# Altium schematic sheet SAMR21_Xplained_Pro_Target_MCU.SchDoc: Target MCU
size A3; Organization: ATMEL Norway; Address1: Vestre Rosten 79; Address2: N-7075 TILLER; Address3: NORWAY; DocumentNumber: A09-2127; Revision: 3; SheetNumber: 2; SheetTotal: 7; PageSetup: Record=PageOptions|CenterHorizontal=True|CenterVertical=True|PrintScale=1.01|XCorrection=1.00|YCorrection=1.00|PrintKind=1|BorderSize=5000000|LeftOffset=0|BottomOffset=0|Orientation=2|PaperLength=1000|PaperWidth=1000|Scale=100|PaperSource=7|PrintQuality=-4|MediaType=1|DitherType=10|PaperKind=A3 (297 x 420 mm)|PrintScaleMode=1
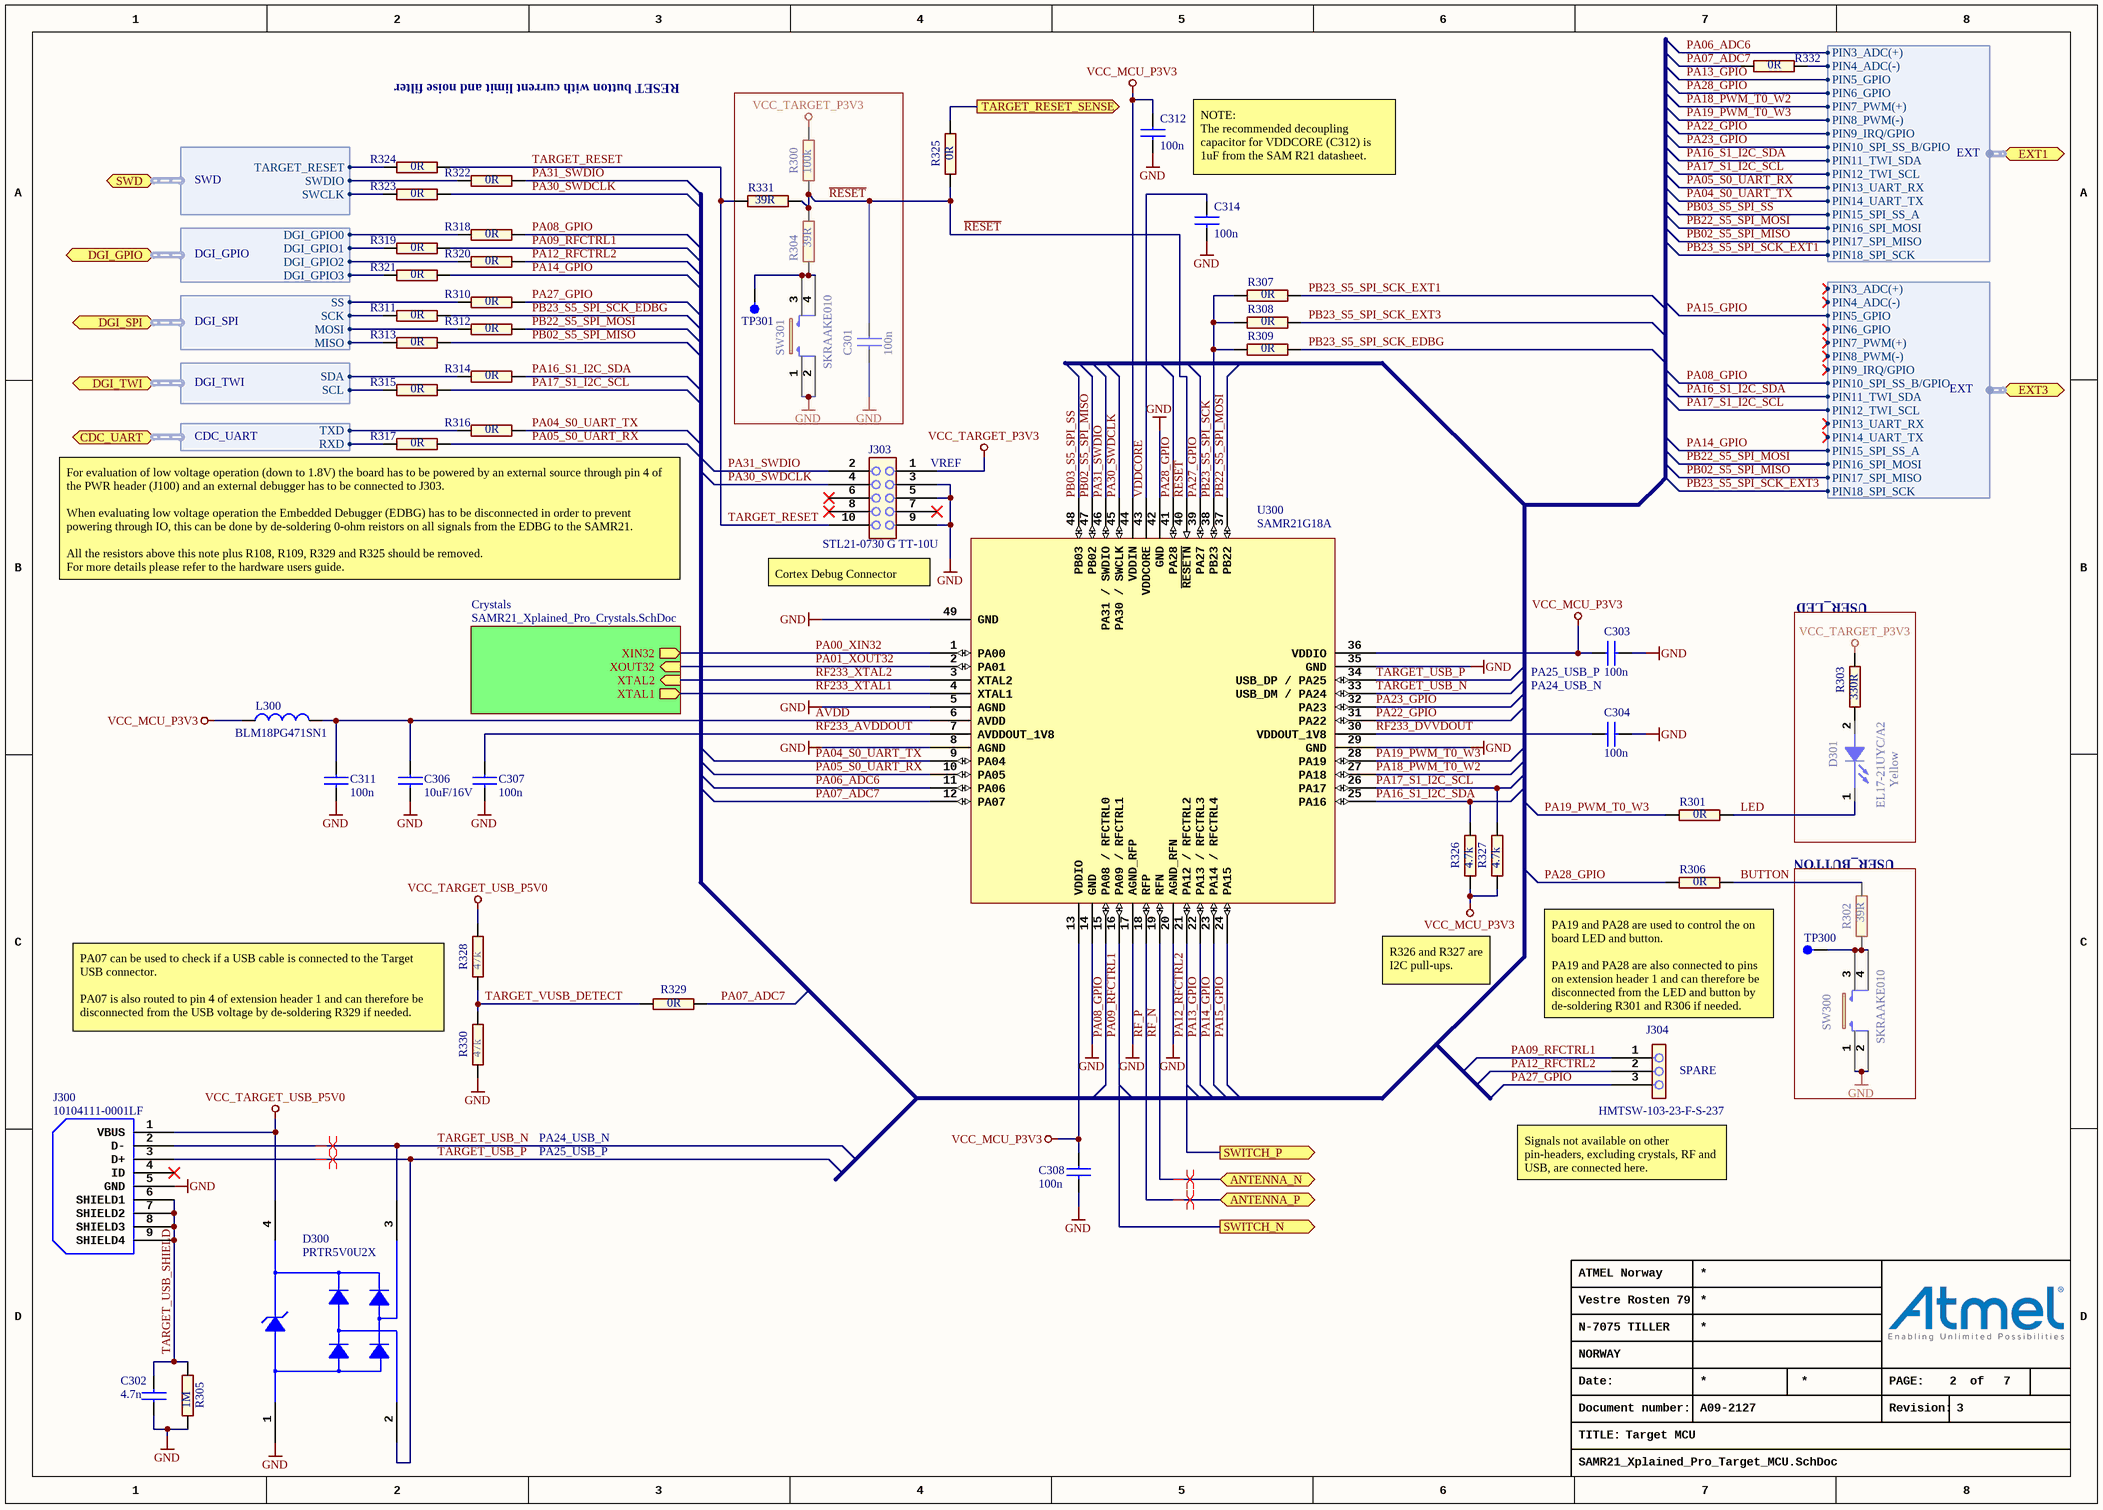
[diagram p0: SAMR21_Xplained_Pro_Target_MCU.SchDoc]

## Parts
C301  100n  [AP1-00053]
C302  value 4.7n  [AP1-00053]  (hidden comment: CAP-NONPOL)
C303  value 100n  [AP1-00001]  (hidden comment: CAP-NONPOL)
C304  value 100n  [AP1-00001]  (hidden comment: CAP-NONPOL)
C306  value 10uF/16V  [AP1-00039]  (hidden comment: CAP-NONPOL)
C307  value 100n  [AP1-00001]  (hidden comment: CAP-NONPOL)
C308  value 100n  [AP1-00001]  (hidden comment: CAP-NONPOL)
C311  value 100n  [AP1-00001]  (hidden comment: CAP-NONPOL)
C312  value 100n  [AP1-00001]  (hidden comment: CAP-NONPOL)
C314  value 100n  [AP1-00001]  (hidden comment: CAP-NONPOL)
D300  PRTR5V0U2X  [AP4-00001]
D301  Yellow  value EL17-21UYC/A2  [AP4-00013]
J300  value 10104111-0001LF  [AP8-00604]  (hidden comment: USB_AB)
J303  MPN: STL21-0730 G TT-10U  [AP8-00257]  (hidden comment: HEADER 2x5)
J304  value HMTSW-103-23-F-S-237  [AP8-00745]  (hidden comment: HEADER 1x3)
L300  value BLM18PG471SN1  [AP3-00005]  (hidden comment: INDUCTOR)
R300  value 100k  [AP2-00000]  (hidden comment: R2)
R301  value 0R  [AP2-00000]  (hidden comment: R2)
R302  value 39R  [AP2-00011]  (hidden comment: R2)
R303  value 330R  [AP2-00000]  (hidden comment: R2)
R304  value 39R  [AP2-00011]  (hidden comment: R2)
R305  value 1M  [AP2-00011]  (hidden comment: R2)
R306  value 0R  [AP2-00000]  (hidden comment: R2)
R307  value 0R  [AP2-00000]  (hidden comment: R2)
R308  value 0R  [AP2-00000]  (hidden comment: R2)
R309  value 0R  [AP2-00000]  (hidden comment: R2)
R310  value 0R  [AP2-00000]  (hidden comment: R2)
R311  value 0R  [AP2-00000]  (hidden comment: R2)
R312  value 0R  [AP2-00000]  (hidden comment: R2)
R313  value 0R  [AP2-00000]  (hidden comment: R2)
R314  value 0R  [AP2-00000]  (hidden comment: R2)
R315  value 0R  [AP2-00000]  (hidden comment: R2)
R316  value 0R  [AP2-00000]  (hidden comment: R2)
R317  value 0R  [AP2-00000]  (hidden comment: R2)
R318  value 0R  [AP2-00000]  (hidden comment: R2)
R319  value 0R  [AP2-00000]  (hidden comment: R2)
R320  value 0R  [AP2-00000]  (hidden comment: R2)
R321  value 0R  [AP2-00000]  (hidden comment: R2)
R322  value 0R  [AP2-00000]  (hidden comment: R2)
R323  value 0R  [AP2-00000]  (hidden comment: R2)
R324  value 0R  [AP2-00000]  (hidden comment: R2)
R325  value 0R  [AP2-00000]  (hidden comment: R2)
R326  value 4.7k  [AP2-00000]  (hidden comment: R2)
R327  value 4.7k  [AP2-00000]  (hidden comment: R2)
R328  value 47k  [AP2-00000]  (hidden comment: R2)
R329  value 0R  [AP2-00000]  (hidden comment: R2)
R330  value 47k  [AP2-00000]  (hidden comment: R2)
R331  value 39R  [AP2-00011]  (hidden comment: R2)
R332  value 0R  [AP2-00000]  (hidden comment: R2)
SW300  value SKRAAKE010  [AP8-00137]  (hidden comment: Can be ordered in low volumes from Mouser)
SW301  value SKRAAKE010  [AP8-00137]  (hidden comment: Can be ordered in low volumes from Mouser)
TP300  TESTPOINT  [AP8-00010]  (value not drawn)  (no BOM)
TP301  TESTPOINT  [AP8-00010]  (value not drawn)  (no BOM)
U300  value SAMR21G18A  [AP6-00171]  (hidden comment: SAMR21G)

## Blocks framed on the sheet
USER_LED: D301 R303
USER_BUTTON: R302 SW300 TP300

## Sub-sheets
Crystals = SAMR21_Xplained_Pro_Crystals.SchDoc: XOUT32 (in), XIN32 (out), XTAL1 (out), XTAL2 (in)

## Ports
ANTENNA_N (bidir), ANTENNA_P (bidir), CDC_UART (harness CDC_UART), DGI_GPIO (harness DGI_GPIO), DGI_SPI (harness DGI_SPI), DGI_TWI (harness DGI_TWI), EXT1 (harness EXT), EXT3 (harness EXT), SWD (harness SWD), SWITCH_N (out), SWITCH_P (out), TARGET_RESET_SENSE (out)

## Harnesses
DGI_GPIO: DGI_GPIO0, DGI_GPIO1, DGI_GPIO2, DGI_GPIO3
DGI_SPI: MISO, MOSI, SCK, SS
DGI_TWI: SCL, SDA
CDC_UART: RXD, TXD
EXT: PIN10_SPI_SS_B/GPIO, PIN11_TWI_SDA, PIN12_TWI_SCL, PIN13_UART_RX, PIN14_UART_TX, PIN15_SPI_SS_A, PIN16_SPI_MOSI, PIN17_SPI_MISO, PIN18_SPI_SCK, PIN3_ADC(+), PIN4_ADC(-), PIN5_GPIO, PIN6_GPIO, PIN7_PWM(+), PIN8_PWM(-), PIN9_IRQ/GPIO
SWD: SWCLK, SWDIO, TARGET_RESET

## Nets
GND: C301.2 C302.1 C303.2 C304.2 C306.2 C307.2 C308.2 C311.2 C312.2 C314.2 D300.1(GND) J300.5(GND) J303.3 J303.5 J303.9 R305.1 R330.1 SW300.1 SW300.2 SW301.1 SW301.2 U300.5(AGND) U300.8(AGND) U300.14(GND) U300.17(AGND_RFP) U300.20(AGND_RFN) U300.29(GND) U300.35(GND) U300.42(GND) U300.49(GND)
VCC_MCU_P3V3: C303.1 C308.1 C312.1 L300.1 R326.1 R327.1 U300.13(VDDIO) U300.36(VDDIO) U300.44(VDDIN)
VCC_TARGET_P3V3: J303.1 R300.2 R303.2
VCC_TARGET_USB_P5V0: D300.4(VCC) J300.1(VBUS) R328.2
AVDD: C306.1 C311.1 L300.2 U300.6(AVDD)
BUTTON: R302.2 R306.2
LED: D301.1(CATHODE) R301.2
PA00_XIN32: U300.1(PA00) ; sheet Crystals/XIN32
PA01_XOUT32: U300.2(PA01) ; sheet Crystals/XOUT32
PA04_S0_UART_TX: R316.2 U300.9(PA04) ; port EXT1.PIN14_UART_TX
PA05_S0_UART_RX: R317.2 U300.10(PA05) ; port EXT1.PIN13_UART_RX
PA06_ADC6: U300.11(PA06) ; port EXT1.PIN3_ADC(+)
PA07_ADC7: R329.2 R332.1 U300.12(PA07)
PA08_GPIO: R318.2 U300.15(PA08_/_RFCTRL0) ; port EXT3.PIN10_SPI_SS_B/GPIO
PA09_RFCTRL1: J304.1 R319.2 U300.16(PA09_/_RFCTRL1) ; port SWITCH_N
PA12_RFCTRL2: J304.2 R320.2 U300.21(PA12_/_RFCTRL2) ; port SWITCH_P
PA13_GPIO: U300.22(PA13_/_RFCTRL3) ; port EXT1.PIN5_GPIO
PA14_GPIO: R321.2 U300.23(PA14_/_RFCTRL4) ; port EXT3.PIN15_SPI_SS_A
PA15_GPIO: U300.24(PA15) ; port EXT3.PIN5_GPIO
PA16_S1_I2C_SDA: R314.2 R326.2 U300.25(PA16) ; port EXT1.PIN11_TWI_SDA, port EXT3.PIN11_TWI_SDA
PA17_S1_I2C_SCL: R315.2 R327.2 U300.26(PA17) ; port EXT1.PIN12_TWI_SCL, port EXT3.PIN12_TWI_SCL
PA18_PWM_T0_W2: U300.27(PA18) ; port EXT1.PIN7_PWM(+)
PA19_PWM_T0_W3: R301.1 U300.28(PA19) ; port EXT1.PIN8_PWM(-)
PA22_GPIO: U300.31(PA22) ; port EXT1.PIN9_IRQ/GPIO
PA23_GPIO: U300.32(PA23) ; port EXT1.PIN10_SPI_SS_B/GPIO
PA27_GPIO: J304.3 R310.2 U300.39(PA27)
PA28_GPIO: R306.1 U300.41(PA28) ; port EXT1.PIN6_GPIO
PA30_SWDCLK: J303.4 R323.2 U300.45(PA30_/_SWCLK)
PA31_SWDIO: J303.2 R322.2 U300.46(PA31_/_SWDIO)
PB02_S5_SPI_MISO: R313.2 U300.47(PB02) ; port EXT1.PIN17_SPI_MISO, port EXT3.PIN17_SPI_MISO
PB03_S5_SPI_SS: U300.48(PB03) ; port EXT1.PIN15_SPI_SS_A
PB22_S5_SPI_MOSI: R312.2 U300.37(PB22) ; port EXT1.PIN16_SPI_MOSI, port EXT3.PIN16_SPI_MOSI
PB23_S5_SPI_SCK: R307.1 R308.1 R309.1 U300.38(PB23)
PB23_S5_SPI_SCK_EDBG: R309.2 R311.2
PB23_S5_SPI_SCK_EXT1: R307.2 ; port EXT1.PIN18_SPI_SCK
PB23_S5_SPI_SCK_EXT3: R308.2 ; port EXT3.PIN18_SPI_SCK
~{RESET}: C301.1 R300.1 R304.2 R325.1 R331.2 U300.40(~{RESETN})
RF233_AVDDOUT: C307.1 U300.7(AVDDOUT_1V8)
RF233_DVVDOUT: C304.1 U300.30(VDDOUT_1V8)
RF233_XTAL1: U300.4(XTAL1) ; sheet Crystals/XTAL1
RF233_XTAL2: U300.3(XTAL2) ; sheet Crystals/XTAL2
RF_N: U300.19(RFN) ; port ANTENNA_N
RF_P: U300.18(RFP) ; port ANTENNA_P
TARGET_RESET: J303.10 R324.2 R331.1
TARGET_RESET_SENSE: R325.2 ; port TARGET_RESET_SENSE
TARGET_USB_N: D300.3(I/O_2) J300.2(D-) U300.33(USB_DM_/_PA24)
TARGET_USB_P: D300.2(I/O_1) J300.3(D+) U300.34(USB_DP_/_PA25)
TARGET_USB_SHIELD: C302.2 J300.6(SHIELD1) J300.7(SHIELD2) J300.8(SHIELD3) J300.9(SHIELD4) R305.2
TARGET_VUSB_DETECT: R328.1 R329.1 R330.2
VDDCORE: C314.1 U300.43(VDDCORE)
NetD301_2: D301.2(ANODE) R303.1
NetR302_1: R302.1 SW300.3 SW300.4 TP300.1
NetR304_1: R304.1 SW301.3 SW301.4 TP301.1
NetR310_1: R310.1 ; port DGI_SPI.SS
NetR311_1: R311.1 ; port DGI_SPI.SCK
NetR312_1: R312.1 ; port DGI_SPI.MOSI
NetR313_1: R313.1 ; port DGI_SPI.MISO
NetR314_1: R314.1 ; port DGI_TWI.SDA
NetR315_1: R315.1 ; port DGI_TWI.SCL
NetR316_1: R316.1 ; port CDC_UART.TXD
NetR317_1: R317.1 ; port CDC_UART.RXD
NetR318_1: R318.1 ; port DGI_GPIO.DGI_GPIO0
NetR319_1: R319.1 ; port DGI_GPIO.DGI_GPIO1
NetR320_1: R320.1 ; port DGI_GPIO.DGI_GPIO2
NetR321_1: R321.1 ; port DGI_GPIO.DGI_GPIO3
NetR322_1: R322.1 ; port SWD.SWDIO
NetR323_1: R323.1 ; port SWD.SWCLK
NetR324_1: R324.1 ; port SWD.TARGET_RESET
NetR332_2: R332.2 ; port EXT1.PIN4_ADC(-)

Not connected (* = marked no-connect by the designer): J300 4(ID)*; J303 6* 7* 8*

## Layout directives
differential pair: RF_N, RF_P, TARGET_USB_N, TARGET_USB_P

## Notes on the sheet
- RESET button with current limit and noise filter
- NOTE:
  The recommended decoupling capacitor for VDDCORE (C312) is 1uF from the SAM R21 datasheet.
- (near J303) VREF
- (near R317) For evaluation of low voltage operation (down to 1.8V) the board has to be powered by an external source through pin 4 of the PWR header (J100) and an external debugger has to be connected to J303.
  When evaluating low voltage operation the Embedded Debugger (EDBG) has to be disconnected in order to prevent powering through IO, this can be done by de-soldering 0-ohm reistors on all signals from the EDBG to the SAMR21.
  All the resistors above this note plus R108, R109, R329 and R325 should be removed.
  For more details please refer to the hardware users guide.
- Cortex Debug Connector
- (near C303) PA25_USB_P
- PA24_USB_N
- R326 and R327 are I2C pull-ups.
- PA07 can be used to check if a USB cable is connected to the Target USB connector.
  PA07 is also routed to pin 4 of extension header 1 and can therefore be disconnected from the USB voltage by de-soldering R329 if needed.
- PA19 and PA28 are used to control the on board LED and button.
  PA19 and PA28 are also connected to pins on extension header 1 and can therefore be disconnected from the LED and button by de-soldering R301 and R306 if needed.
- (near J304) SPARE
- PA25_USB_P
- (near J304) Signals not available on other pin-headers, excluding crystals, RF and USB, are connected here.
- Date:
- PAGE:
- of
- TITLE:
- Document number:
- Revision:

## Library data of the parts
C301 C303 C304 C307 C308 C311 C312 C314 = A01-0246: Ceramic capacitor, SMD 0402, X7R, 16V, +/-10%; PartGroup: Capacitors,Ceramic,SMD 0402; Manufacturer: Kemet; MPN: C0402C104K4RACTU; TemperatureRange: -55 - +125 deg C; AN: A01-0246; Tolerance: 16V, +/-10%; Height: 0,5
  C301: Value: 100n
C302 = A01-0046: Ceramic capacitor, SMD 0402, X7R, 25V, +/-10%; PartGroup: Capacitors,Ceramic,SMD 0402; TemperatureRange: -55 - +125 deg C; AN: A01-0046; Tolerance: 25V, +/-10%; Height: 0.550000011920929
C306 = A01-0491: Ceramic capacitor, SMD 0603, X5R, 16V, 10UF ± 20% (High Density); PartGroup: Capacitors,Ceramic,SMD 0603; Manufacturer: Taiyo Yuden; MPN: EMK107BBJ106MA-T; AN: A01-0491
D300 = A06-0236: Double rail-to-rail USB ESD protection diode; OrcadPartType: Integrated Circuits&Special function&Protection; Manufacturer: Philips; TemperatureRange: -40 to +85 C; AN: A06-0236; Value: PRTR5V0U2X; PartType: Buy; Height: 1,10000002384186; MPN: PRTR5V0U2X
D301 = A10-0019: LED, Yellow, Wave length=591nm, SMD 0805, ±70°; PartGroup: Opto,LEDs,SMD; Manufacturer: Everlight; MPN: 17-21UYC/S530-A3/TR8; TemperatureRange: -40 to +85 deg C; AN: A10-0019; Height: 1,10000002384186
J300 = A08-1368: Micro USB AB Connector; PartGroup: Mechanical devices,Connectors,USB; Manufacturer: FCI; AN: A08-1368; Height: 2.59999990463257; MPN: 10104111-0001LF
J303 = A08-0385: 2x5 pin header, 1.27mm pitch, THM; PartGroup: Mechanical devices,Connectors,Pin headers; Manufacturer: Garry; Value: PIN HEADER 2x5; AN: A08-0385; Height: 7.30000019073486
J304 = A08-1799: 1x3 pin header, 2.54mm pitch, Pin-in-Paste THM, 1mm hole; AN: A08-1799
L300 = A03-0035: SMD RF inductor 0603. Z=470Ohm (@100MHz), Max R(dc)=0.65Ohm, Max current=1A; PartGroup: Inductors,EMI; Manufacturer: Murata; Tolerance: ±25%; TemperatureRange: -55°C to +125°C; AN: A03-0035; Height: 0,800000011920929; MPN: BLM18PG471SN1
R300 = A02-0260: Thick film resistor, SMD 0402, 1/16W, 1%; PartGroup: Resistors,SMD,0402 1%; TemperatureRange: -55 - +125 deg C; AN: A02-0260; Tolerance: 1 %; Height: 0,349999994039536
R301 R306-R325 R329 R332 = A02-0163: RES 0.0 OHM 1/16W 0402 SMD; PartGroup: Resistors,SMD,0402 1%; MPN: RMCF0402ZT0R00; Tolerance: 1 %; TemperatureRange: -55 - +125 deg C; AN: A02-0163; Height: 0,349999994039536
R302 R304 R331 = A02-0178: Thick film resistor, SMD 0402, 1/16W, 1%; PartGroup: Resistors,SMD,0402 1%; TemperatureRange: -55 - +125 deg C; AN: A02-0178; Tolerance: 1 %; Height: 0,349999994039536
R303 = A02-0200: Thick film resistor, SMD 0402, 1/16W, 1%; PartGroup: Resistors,SMD,0402 1%; TemperatureRange: -55 - +125 deg C; AN: A02-0200; Tolerance: 1 %; Height: 0.349999994039536
R305 = A02-0284: Thick film resistor, SMD 0402, 1/16W, 1%; PartGroup: Resistors,SMD,0402 1%; Manufacturer: KOA; MPN: RK73H1ETTP1004F; TemperatureRange: -55 - +125 deg C; AN: A02-0284; Tolerance: 1 %; Height: 0,349999994039536
R326 R327 = A02-0228: Thick film resistor, SMD 0402, 1/16W, 1%; PartGroup: Resistors,SMD,0402 1%; TemperatureRange: -55ï¿½ to +125ï¿½C; AN: A02-0228; Tolerance: 1 %; Height: 0,349999994039536
R328 R330 = A02-0252: Thick film resistor, SMD 0402, 1/16W, 1%; PartGroup: Resistors,SMD,0402 1%; TemperatureRange: -55 - +125 deg C; AN: A02-0252; Tolerance: 1 %; Height: 0.349999994039536
SW300 SW301 = A08-0790: 6.2x6.2 mm SMD tact switch, same as A08-0091 but less force is needed; PartGroup: Mechanical devices,Switches,SMD; Manufacturer: ALPS; TemperatureRange: -30 - +90 deg C; AN: A08-0790; Height: 5,09999990463257; MPN: SKRAAKE010
TP300 TP301 = A08-0004: Single SMD testpad; PartGroup: Mechanical devices,Connectors,Test points; AN: A08-0004; Height: 0
U300 = A06-1046: Atmel 32-bit Cortex M0+ MCU with RF233 SIP.; PartGroup: Integrated Circuits,MCU, MPU, DSP,ARM MCU; MPN: SAMR21G18A-MUT; TemperatureRange: -40 to +85 deg celcius; AN: A06-1046; Height: 0,850000023841858; Manufacturer: ATMEL